# EAGLE design Rev1 (EAGLE 6.5.0)
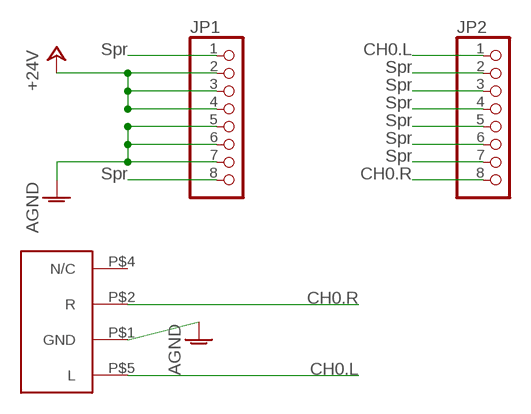
[diagram p0: schematic, sheet 1]

## Parts
JP1  PINHD-1X8  [1X08]
JP2  PINHD-1X8  [1X08]
U$1  161-3509-E  [161-3509-E]

## Nets
+24V: JP1.2 JP1.3 JP1.4
AGND: JP1.5 JP1.6 JP1.7 U$1.P$1(GND)
CH0.L: JP2.1 U$1.P$5(L)
CH0.R: JP2.8 U$1.P$2(R)
JP1-P1: JP1.1
JP1-P2: JP1.8
JP2-P2: JP2.2
JP2-P3: JP2.3
JP2-P4: JP2.4
JP2-P5: JP2.5
JP2-P6: JP2.6
JP2-P7: JP2.7
Unconnected: U$1.P$4(N/C)

## Notes on the sheet
- Spr | CH0.L
- Spr
- Spr
- Spr
- Spr
- Spr
- Spr
- Spr | CH0.R
- CH0.R
- CH0.L

## Library data of the parts
JP1 JP2 = pinhead+:PINHD-1X8: PIN HEADER
U$1 = C1-2015:161-3509-E

## Board
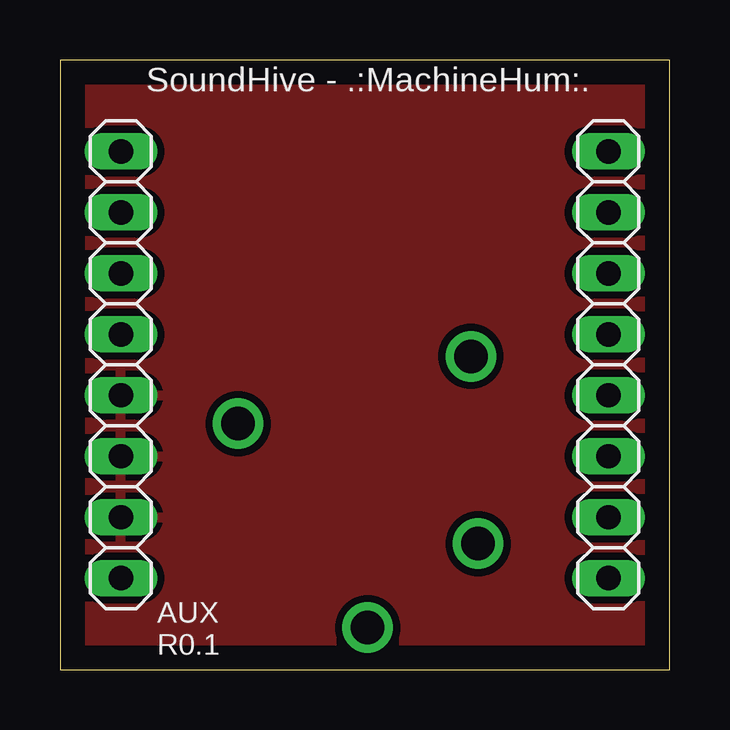
[diagram p1: board, top side]
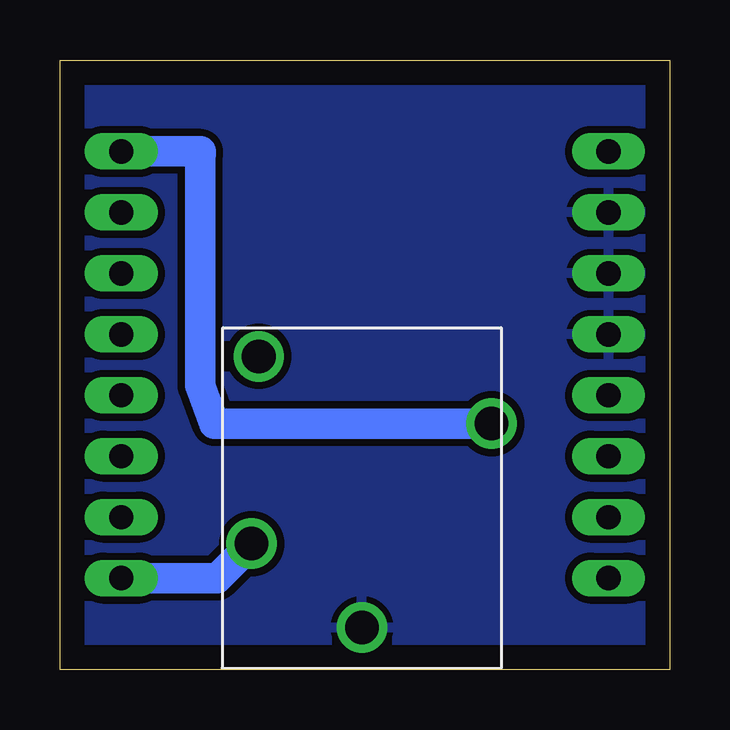
[diagram p2: board, bottom side, seen from below]

Size 25.4 x 25.4 mm. Coordinates in mm from the lower left corner, seen from the top.
Outline: 0,0 25.4,0 25.4,25.4 0,25.4 0,0
Copper layers (1*16): Top 0.035mm / dielectric 1.5mm / Bottom 0.035mm
Design rules "default": minimum track width 10mil, minimum drill 24mil, track to track 8mil, track to pad 8mil, pad to pad 8mil, via to via 8mil, smd to smd 8mil, copper to edge 40mil, drill to drill 8mil, minimum pad ring 10mil, minimum via ring 8mil, stop-mask expansion 4mil, vias tented up to drill 0mil, thermal gap 10mil

### Footprints (pad centres in the part's own frame; a part is rotated, then mirrored left to right if it is on the bottom)
1X08 = drill 1.016 long: 1 -8.89,0; 2 -6.35,0; 3 -3.81,0; 4 -1.27,0; 5 1.27,0; 6 3.81,0; 7 6.35,0; 8 8.89,0
161-3509-E = drill 1.4: P$1 1.7,-5.8; P$2 10.2,-11.2; P$4 13,-1.5; P$5 5.2,-1.2

### Placement (x,y rotation side)
JP1  2.54,12.7 90 top
JP2  22.85,12.7 90 top
U$1  18.62,0.05 90 bottom

### Tracks (layer width: path | path; a pad name or v marks a point on that pad's centre or on a via)
+24V
  pour Top (isolate 0.305): 0,0 0,25.4 25.4,25.4 25.4,0
AGND
  pour Bottom (isolate 0.305): 0,0 0,25.4 25.4,25.4 25.4,0
CH0.L
  Bottom 1.27: U$1.P$5 18.86,3.81 JP2.1
CH0.R
  Bottom 1.27: U$1.P$2 18.97,10.25 19.56,11.82 19.56,21.15 19.54,21.6 JP2.8

### Text on the board
tPlace: SoundHive - .:MachineHum:. | AUX / R0.1